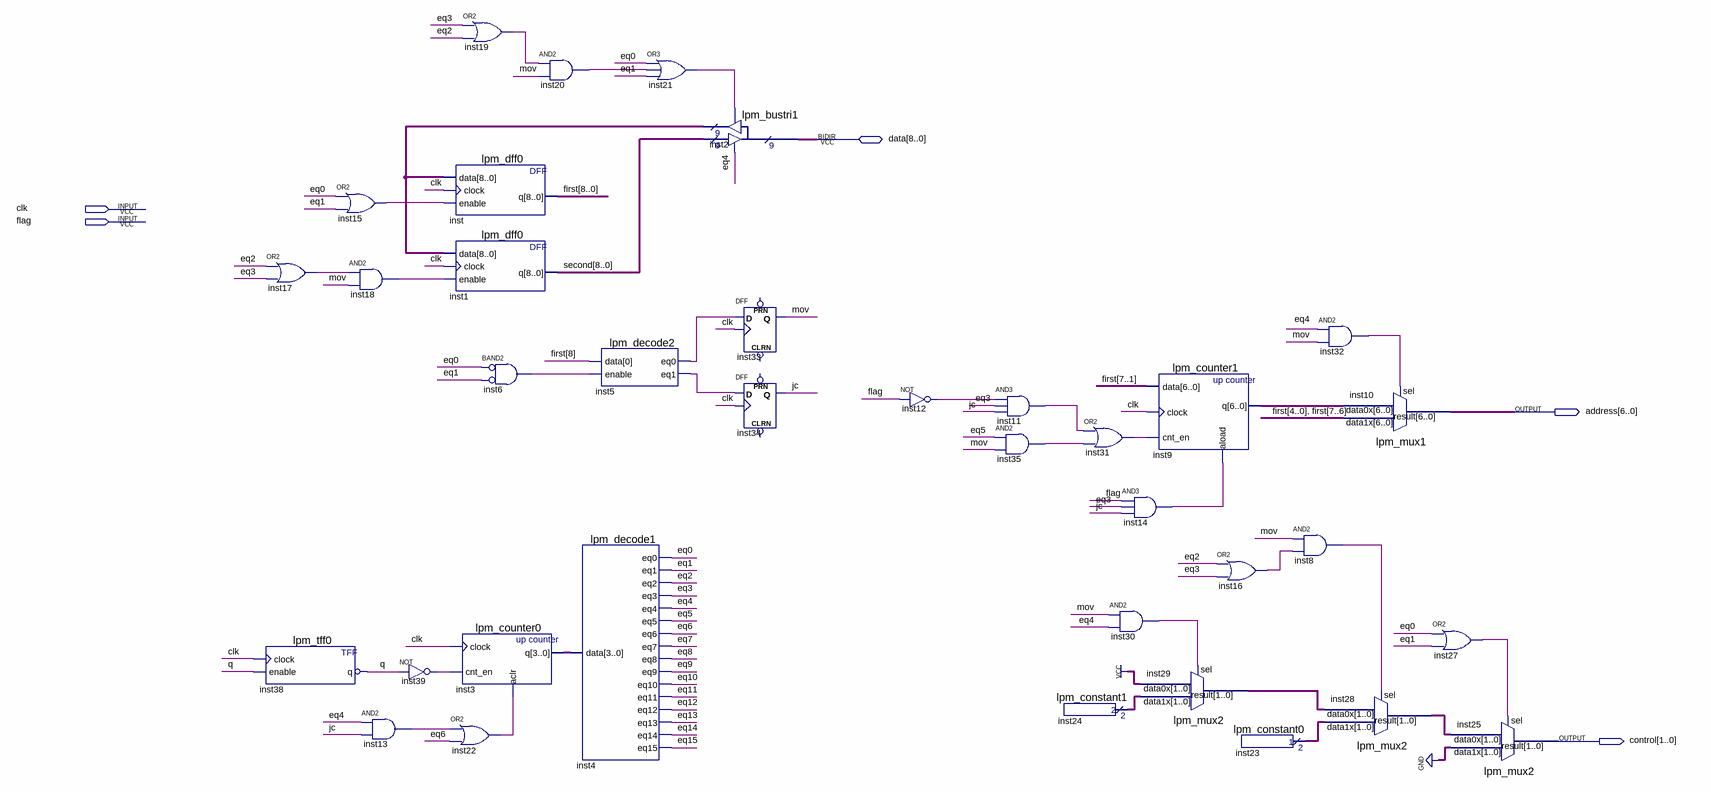
[diagram p0: schematic sheet]
// Quartus schematic YY.bdf as structural Verilog: 36 symbols, 5 pins
module YY (
  input  clk,
  input  flag,
  inout  [8:0] data,
  output [6:0] address,
  output [1:0] control
);

  wire eq0, eq1, eq2, eq3, eq4, eq5, eq6, eq7, eq8, eq9, eq10, eq11, eq12, eq13, eq14, eq15, inst5_eq0,
       inst5_eq1, inst6_out, inst8_out, inst11_out, inst12_out, inst13_out, inst14_out, inst15_out,
       inst16_out, inst17_out, inst18_out, inst19_out, inst20_out, inst21_out, inst22_out, inst27_out,
       inst30_out, inst31_out, inst32_out, inst35_out, inst38_q, inst39_out, jc, mov, q;
  wire [1:0] inst23_result, inst24_result, inst28_result, inst29_result;
  wire [3:0] inst3_q;
  wire [6:0] inst9_q;
  wire [8:0] first, inst2_result, second;

  or inst17 (inst17_out, eq2, eq3);
  lpm_tff0 inst38 (.clock(clk), .enable(q), .q(inst38_q));
  not inst38_q_inverted (q, inst38_q);
  or inst15 (inst15_out, eq0, eq1);
  and inst18 (inst18_out, inst17_out, mov);
  and inst13 (inst13_out, eq4, jc);
  not inst39 (inst39_out, q);
  or inst19 (inst19_out, eq3, eq2);
  lpm_dff0 inst (.data(inst2_result), .clock(clk), .enable(inst15_out), .q(first));
  lpm_dff0 inst1 (.data(inst2_result), .clock(clk), .enable(inst18_out), .q(second));
  and inst6 (inst6_out, ~eq0, ~eq1);  // BAND2
  lpm_counter0 inst3 (.clock(clk), .cnt_en(inst39_out), .aclr(inst22_out), .q(inst3_q));
  or inst22 (inst22_out, inst13_out, eq6);
  and inst20 (inst20_out, inst19_out, mov);
  lpm_decode1 inst4 (
    .data(inst3_q), .eq0(eq0), .eq1(eq1), .eq2(eq2), .eq3(eq3), .eq4(eq4), .eq5(eq5), .eq6(eq6), .eq7(eq7),
    .eq8(eq8), .eq9(eq9), .eq10(eq10), .eq11(eq11), .eq12(eq12), .eq13(eq13), .eq14(eq14), .eq15(eq15));
  lpm_decode2 inst5 (.data(first[8]), .enable(inst6_out), .eq0(inst5_eq0), .eq1(inst5_eq1));
  or inst21 (inst21_out, eq0, inst20_out, eq1);
  lpm_bustri1 inst2 (.enabledt(eq4), .data(second), .enabletr(inst21_out), .result(inst2_result), .tridata(data));
  DFF inst33 (.CLK(clk), .D(inst5_eq0), .Q(mov));  // open: CLRN, PRN
  DFF inst34 (.CLK(clk), .D(inst5_eq1), .Q(jc));  // open: CLRN, PRN
  not inst12 (inst12_out, flag);
  and inst11 (inst11_out, inst12_out, eq3, jc);
  and inst35 (inst35_out, eq5, mov);
  or inst31 (inst31_out, inst11_out, inst35_out);
  lpm_constant1 inst24 (.result(inst24_result));
  and inst14 (inst14_out, flag, eq3, jc);
  and inst30 (inst30_out, mov, eq4);
  lpm_mux2 inst29 (.data1x(inst24_result), .data0x(2'b11), .sel(inst30_out), .result(inst29_result));
  lpm_counter1 inst9 (.data(first[7:1]), .clock(clk), .cnt_en(inst31_out), .aload(inst14_out), .q(inst9_q));
  or inst16 (inst16_out, eq2, eq3);
  lpm_constant0 inst23 (.result(inst23_result));
  and inst8 (inst8_out, mov, inst16_out);
  and inst32 (inst32_out, eq4, mov);
  lpm_mux1 inst10 (.data1x({first[4:0], first[7:6]}), .data0x(inst9_q), .sel(inst32_out), .result(address));
  lpm_mux2 inst28 (.data1x(inst23_result), .data0x(inst29_result), .sel(inst8_out), .result(inst28_result));
  or inst27 (inst27_out, eq0, eq1);
  lpm_mux2 inst25 (.data1x(2'b00), .data0x(inst28_result), .sel(inst27_out), .result(control));
endmodule
